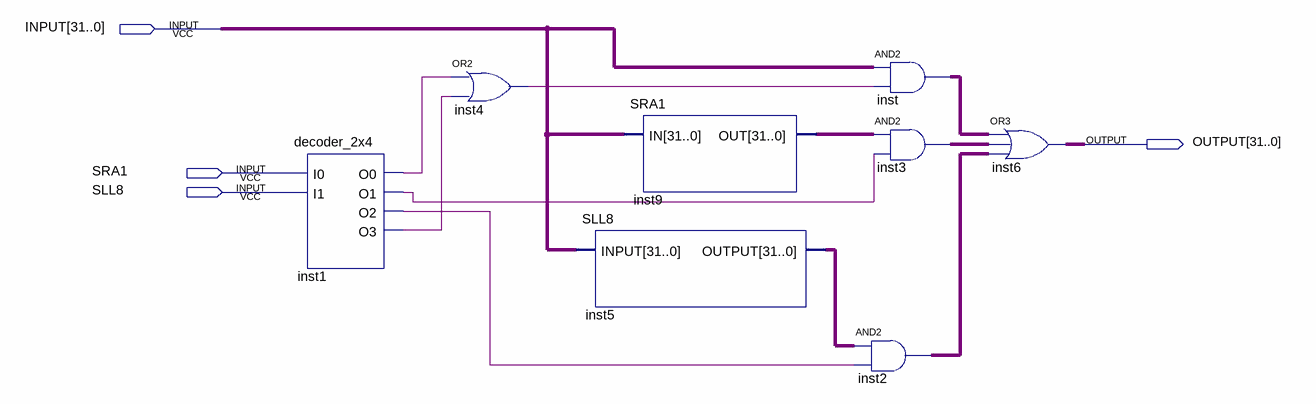
[diagram p0: schematic sheet]
// Quartus schematic SHIFTER.bdf as structural Verilog: 8 symbols, 4 pins
module SHIFTER (
  input  [31:0] INPUT,
  input  SRA1,
  input  SLL8,
  output [31:0] OUTPUT
);

  wire inst1_o0, inst1_o1, inst1_o2, inst1_o3, inst4_out;
  wire [31:0] inst2_out, inst3_out, inst5_output, inst9_out, inst_out;

  decoder_2x4 inst1 (.I0(SRA1), .I1(SLL8), .O0(inst1_o0), .O1(inst1_o1), .O2(inst1_o2), .O3(inst1_o3));
  or inst4 (inst4_out, inst1_o0, inst1_o3);
  SRA1 inst9 (.IN(INPUT), .OUT(inst9_out));
  SLL8 inst5 (.INPUT(INPUT), .OUTPUT(inst5_output));
  assign inst2_out = inst5_output & {32{inst1_o2}};  // AND2 inst2, 32 bits wide
  assign inst_out = INPUT & {32{inst4_out}};  // AND2 inst, 32 bits wide
  assign inst3_out = inst9_out & {32{inst1_o1}};  // AND2 inst3, 32 bits wide
  assign OUTPUT = inst_out | inst3_out | inst2_out;  // OR3 inst6, 32 bits wide
endmodule
